# EAGLE schematic untitled (EAGLE 9.5.2)
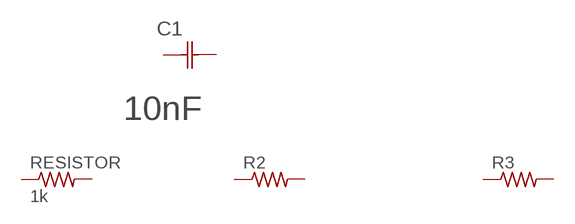
[diagram p0: schematic, sheet 1]

## Parts
C1  10nF  C1206C103K5RACTU  [CAPC3216X88N]
R2  R-US_R0805  [R0805]
R3  R-US_R0805  [R0805]
RESISTOR  1k  R-US_R0805  [R0805]
Unconnected: C1.1(C1) C1.2(C2) R2.1 R2.2 R3.1 R3.2 RESISTOR.1 RESISTOR.2

## Library data of the parts
C1 = Kemet_By_element14_Batch_1:C1206C103K5RACTU: CAPACITOR, 1206; MPN: C1206C103K5RACTU; OC_FARNELL: 1414713; OC_NEWARK: 61H7741; SUPPLIER: Kemet; TOLERANCE: ±10%; VOLTAGERATING: 50V
R2 R3 RESISTOR = adafruit:R-US_: RESISTOR, American symbol